# EAGLE design vending-machine-i2c-adapter (EAGLE 5.11)
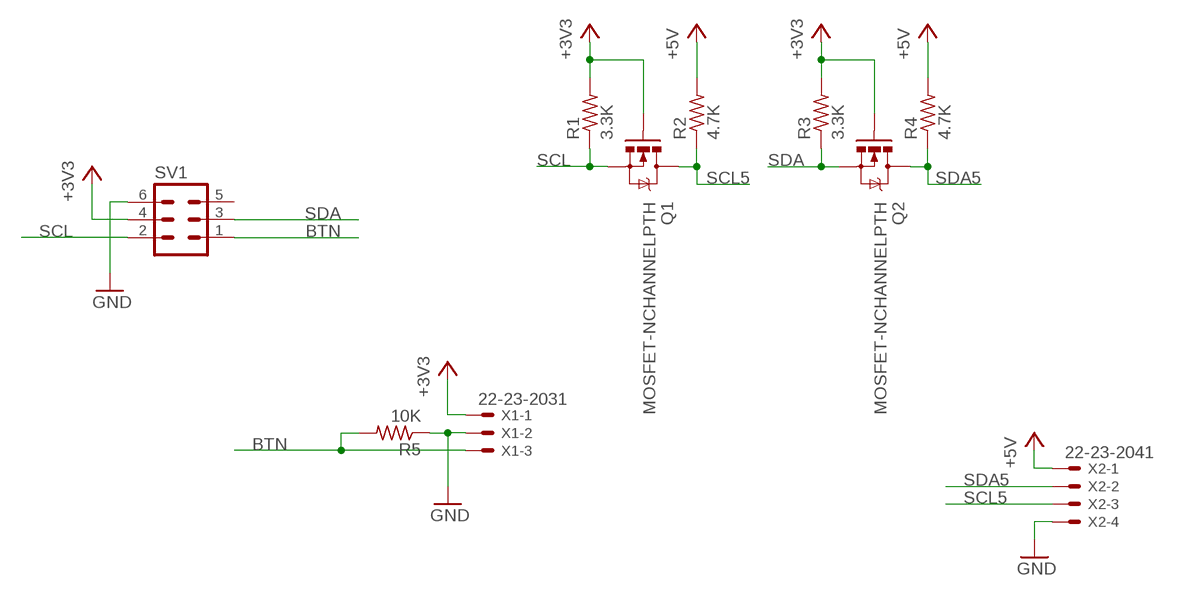
[diagram p0: schematic, sheet 1]

## Parts
Q1  MOSFET-NCHANNELPTH  [TO-92]
Q2  MOSFET-NCHANNELPTH  [TO-92]
R1  3.3K  R-US_0207/10  [0207/10]
R2  4.7K  R-US_0207/10  [0207/10]
R3  3.3K  R-US_0207/10  [0207/10]
R4  4.7K  R-US_0207/10  [0207/10]
R5  10K  R-US_0207/10  [0207/10]
SV1  ML6  [ML6]
X1  22-23-2031  [22-23-2031]
X2  22-23-2041  [22-23-2041]

## Nets
+3V3: Q1.3(G) Q2.3(G) R1.2 R3.2 SV1.4 X1.1
+5V: R2.2 R4.2 X2.1
BTN: R5.2 SV1.1 X1.3
GND: R5.1 SV1.6 X1.2 X2.4
SCL: Q1.2(S) R1.1 SV1.2
SCL5: Q1.1(D) R2.1 X2.3
SDA: Q2.2(S) R3.1 SV1.3
SDA5: Q2.1(D) R4.1 X2.2
Unconnected: SV1.5

## Library data of the parts
Q1 Q2 = SparkFun:MOSFET-NCHANNEL
R1-R5 = rcl:R-US_: RESISTOR, American symbol
SV1 = con-harting-ml:ML6: HARTING; OC_FARNELL: unknown; OC_NEWARK: unknown
X1 = con-molex:22-23-2031: .100" (2.54mm) Center Header - 3 Pin; MF: MOLEX; MPN: 22-23-2031; OC_FARNELL: 1462950; OC_NEWARK: 30C0862
X2 = con-molex:22-23-2041: .100" (2.54mm) Center Header - 4 Pin; MF: MOLEX; MPN: 22-23-2041; OC_FARNELL: 1462920; OC_NEWARK: 38C0355

## Board
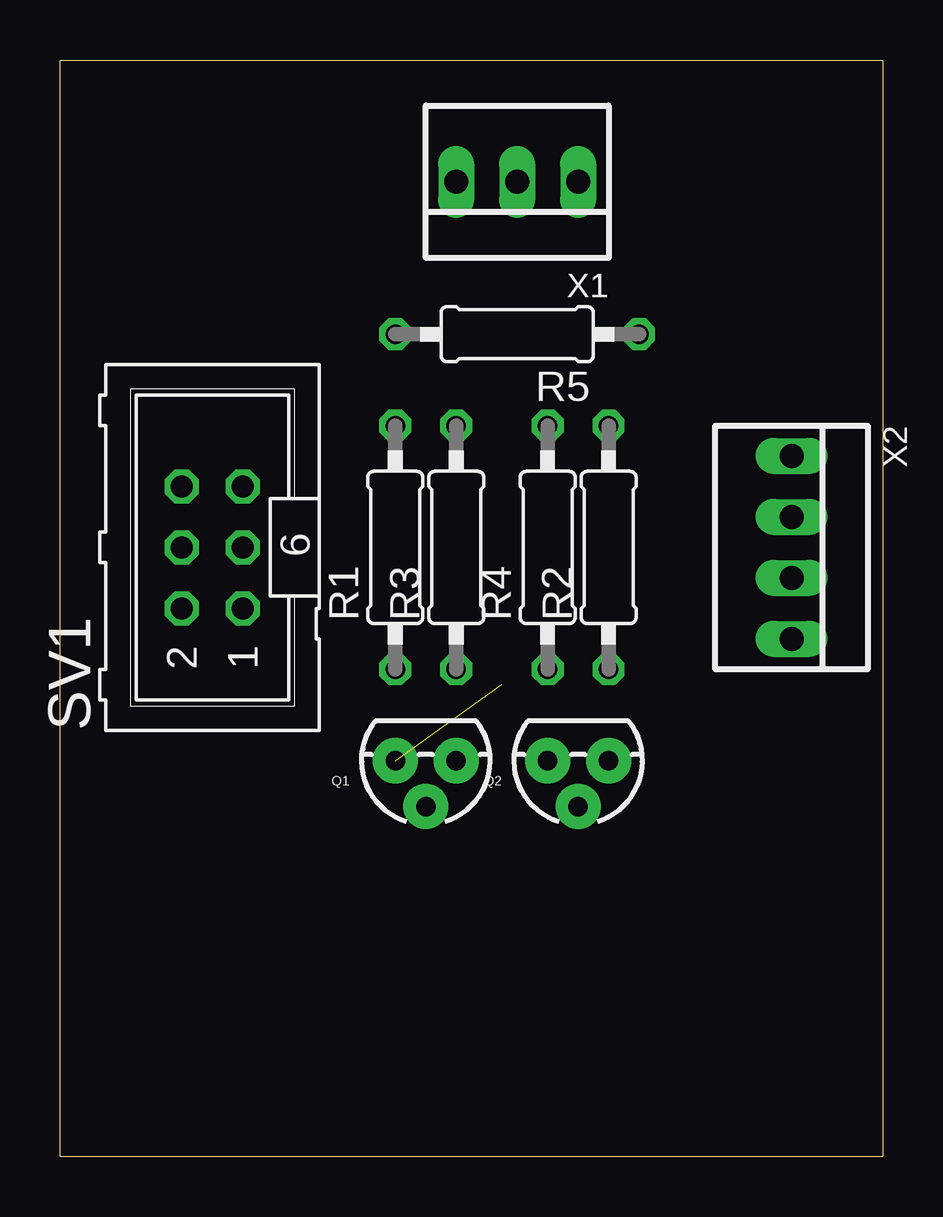
[diagram p1: board, top side]
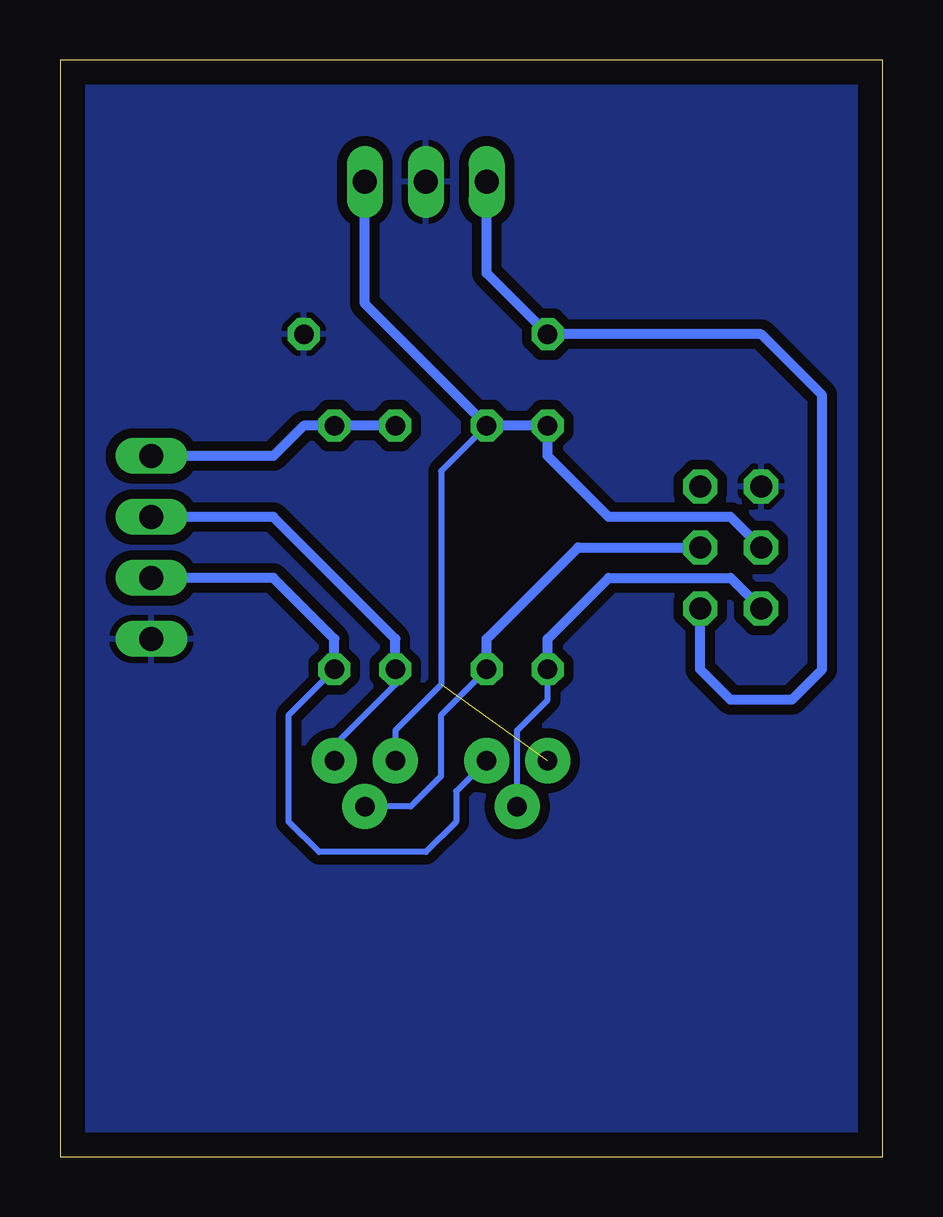
[diagram p2: board, bottom side, seen from below]

Size 34.29 x 45.72 mm. Coordinates in mm from the lower left corner, seen from the top.
Outline: 0,0 0,45.72 34.29,45.72 34.29,0 0,0
Copper layers (1*16): Top 0.035mm / dielectric 1.5mm / Bottom 0.035mm
Design rules "default": minimum track width 10mil, minimum drill 24mil, track to track 8mil, track to pad 8mil, pad to pad 8mil, via to via 8mil, smd to smd 8mil, copper to edge 40mil, drill to drill 8mil, minimum pad ring 10mil, minimum via ring 8mil, stop-mask expansion 4mil, vias tented up to drill 0mil, thermal gap 10mil

### Footprints (pad centres in the part's own frame; a part is rotated, then mirrored left to right if it is on the bottom)
TO-92 = drill 0.813 pad 1.88 round: 1 -1.27,0; 2 0,1.905; 3 1.27,0
0207/10 = drill 0.813 octagon: 1 -5.08,0; 2 5.08,0
ML6 = drill 0.914 octagon: 1 -2.54,-1.27; 2 -2.54,1.27; 3 0,-1.27; 4 0,1.27; 5 2.54,-1.27; 6 2.54,1.27
22-23-2031 = drill 1 long: 1 -2.54,0; 2 0,0; 3 2.54,0
22-23-2041 = drill 1 long: 1 -3.81,0; 2 -1.27,0; 3 1.27,0; 4 3.81,0

### Placement (x,y rotation side)
Q1  15.24,16.51 180 top
Q2  21.59,16.51 180 top
R1  13.97,25.4 90 top
R2  22.86,25.4 90 top
R3  16.51,25.4 90 top
R4  20.32,25.4 90 top
R5  19.05,34.29 180 top
SV1  6.35,25.4 90 top
X1  19.05,40.64 180 top
X2  30.48,25.4 270 top

### Tracks (layer width: path | path; a pad name or v marks a point on that pad's centre or on a via)
+3V3  (1 unrouted)
  Bottom 0.254: Q2.3 20.32,17.78 18.41,19.68 18.41,28.57 R3.2
  Bottom 0.406: SV1.4 6.35,26.67 11.43,26.67 13.97,29.21 R1.2 R3.2 21.59,35.56 X1.1
+5V
  Bottom 0.406: X2.1 25.4,29.21 24.13,30.48 R2.2 R4.2
BTN
  Bottom 0.406: X1.3 16.51,36.83 R5.2 5.08,34.29 2.54,31.75 2.54,20.32 3.81,19.05 6.35,19.05 7.62,20.32 SV1.1
GND
  pour Bottom (isolate 0.406): 0,45.72 34.29,45.72 34.29,0 0,0
SCL
  Bottom 0.254: Q1.2 15.24,17.78 13.97,19.05 R1.1
  Bottom 0.406: SV1.2 6.35,24.13 11.43,24.13 13.97,21.59 R1.1
SCL5
  Bottom 0.254: Q1.1 17.78,15.24 17.78,13.97 19.05,12.7 23.5,12.7 24.77,13.97 24.77,18.41 R2.1
  Bottom 0.406: X2.3 25.4,24.13 22.86,21.59 R2.1
SDA
  Bottom 0.254: Q2.2 19.68,14.61 18.41,15.88 18.41,18.41 R3.1
  Bottom 0.406: SV1.3 12.7,25.4 16.51,21.59 R3.1
SDA5
  Bottom 0.254: R4.1 20.32,19.68 22.86,17.14 Q2.1
  Bottom 0.406: X2.2 25.4,26.67 20.32,21.59 R4.1